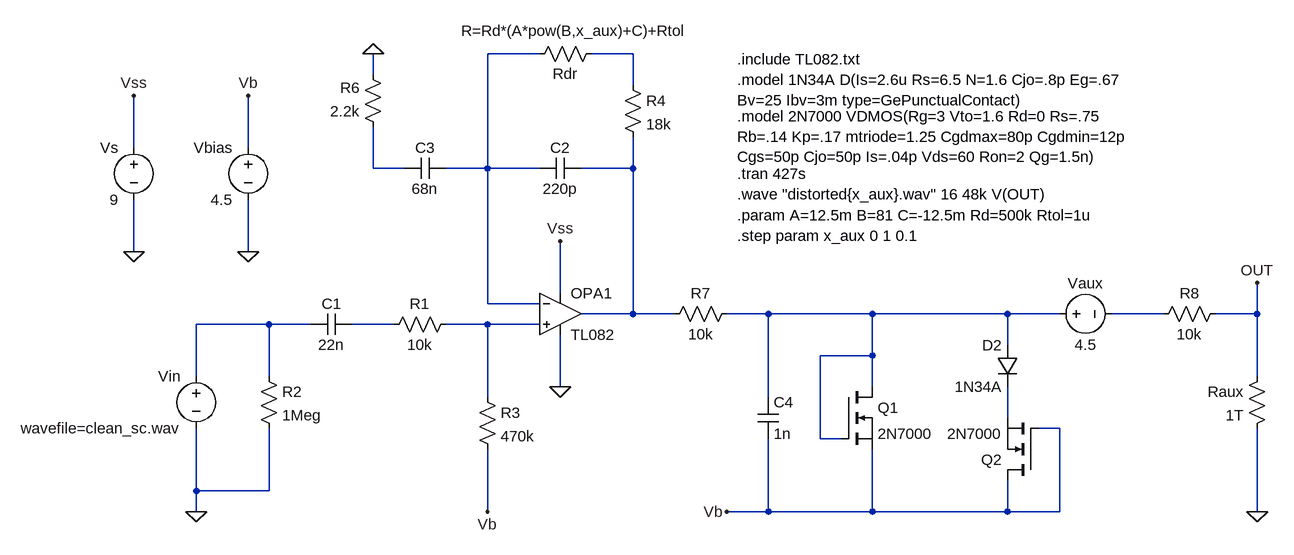
[diagram p0: schematic OCD_Distortion_Circuit.asc]
OCD_Distortion_Circuit.asc, the LTspice schematic file:
Version 4
SHEET 1 2244 884
WIRE -272 -96 -352 -96
WIRE -128 -96 -192 -96
WIRE -528 -64 -528 -96
WIRE -128 -48 -128 -96
WIRE -896 48 -896 -32
WIRE -720 48 -720 -32
WIRE -528 80 -528 16
WIRE -480 80 -528 80
WIRE -352 80 -352 -96
WIRE -352 80 -416 80
WIRE -272 80 -352 80
WIRE -128 80 -128 32
WIRE -128 80 -208 80
WIRE -896 208 -896 128
WIRE -720 208 -720 128
WIRE -240 272 -240 192
WIRE -352 288 -352 80
WIRE -272 288 -352 288
WIRE -128 304 -128 80
WIRE -128 304 -208 304
WIRE -64 304 -128 304
WIRE 80 304 16 304
WIRE 240 304 80 304
WIRE 448 304 240 304
WIRE 528 304 448 304
WIRE 688 304 608 304
WIRE 832 304 832 256
WIRE 832 304 768 304
WIRE -688 320 -800 320
WIRE -624 320 -688 320
WIRE -496 320 -560 320
WIRE -352 320 -416 320
WIRE -272 320 -352 320
WIRE 448 352 448 304
WIRE 240 368 240 304
WIRE 240 368 160 368
WIRE -800 400 -800 320
WIRE -688 400 -688 320
WIRE 832 400 832 304
WIRE -240 416 -240 336
WIRE 240 416 240 368
WIRE -352 432 -352 320
WIRE 80 432 80 304
WIRE 448 464 448 416
WIRE 528 480 496 480
WIRE 160 496 160 368
WIRE 192 496 160 496
WIRE -800 576 -800 480
WIRE -688 576 -688 480
WIRE -688 576 -800 576
WIRE -800 608 -800 576
WIRE -352 608 -352 512
WIRE 80 608 80 496
WIRE 80 608 16 608
WIRE 240 608 240 512
WIRE 240 608 80 608
WIRE 448 608 448 560
WIRE 448 608 240 608
WIRE 528 608 528 480
WIRE 528 608 448 608
WIRE 832 608 832 480
FLAG -352 608 Vb
FLAG -240 416 0
FLAG -800 608 0
FLAG -528 -96 0
FLAG 16 608 Vb
FLAG -240 192 Vss
FLAG 832 608 0
FLAG 832 256 OUT
FLAG -720 -32 Vb
FLAG -896 -32 Vss
FLAG -720 208 0
FLAG -896 208 0
SYMBOL voltage -800 384 M0
SYMATTR InstName Vin
SYMATTR Value wavefile=clean_sc.wav
SYMBOL res -400 304 R90
WINDOW 0 0 56 VBottom 2
WINDOW 3 32 56 VTop 2
SYMATTR InstName R1
SYMATTR Value 10k
SYMBOL cap -560 304 R90
WINDOW 0 0 32 VBottom 2
WINDOW 3 32 32 VTop 2
SYMATTR InstName C1
SYMATTR Value 22n
SYMBOL res -704 384 R0
SYMATTR InstName R2
SYMATTR Value 1Meg
SYMBOL res -368 416 R0
SYMATTR InstName R3
SYMATTR Value 470k
SYMBOL OpAmps\\opamp2 -240 240 R0
SYMATTR InstName OPA1
SYMATTR Value TL082
SYMBOL cap -208 64 R90
WINDOW 0 0 32 VBottom 2
WINDOW 3 32 32 VTop 2
SYMATTR InstName C2
SYMATTR Value 220p
SYMBOL res -144 -64 R0
SYMATTR InstName R4
SYMATTR Value 18k
SYMBOL cap -416 64 R90
WINDOW 0 0 32 VBottom 2
WINDOW 3 32 32 VTop 2
SYMATTR InstName C3
SYMATTR Value 68n
SYMBOL res -512 32 R180
WINDOW 0 36 76 Left 2
WINDOW 3 36 40 Left 2
SYMATTR InstName R6
SYMATTR Value 2.2k
SYMBOL res 32 288 R90
WINDOW 0 0 56 VBottom 2
WINDOW 3 32 56 VTop 2
SYMATTR InstName R7
SYMATTR Value 10k
SYMBOL cap 64 432 R0
SYMATTR InstName C4
SYMATTR Value 1n
SYMBOL diode 464 352 M0
SYMATTR InstName D2
SYMATTR Value 1N34A
SYMBOL nmos 192 416 R0
SYMATTR InstName Q1
SYMATTR Value 2N7000
SYMBOL nmos 496 560 R180
SYMATTR InstName Q2
SYMATTR Value 2N7000
SYMBOL res 784 288 R90
WINDOW 0 0 56 VBottom 2
WINDOW 3 32 56 VTop 2
SYMATTR InstName R8
SYMATTR Value 10k
SYMBOL res -288 -80 R270
WINDOW 0 -30 56 VTop 2
WINDOW 3 67 70 VBottom 2
SYMATTR InstName Rdr
SYMATTR Value R=Rd*(A*pow(B,x_aux)+C)+Rtol
SYMBOL voltage 512 304 R270
WINDOW 0 32 56 VTop 2
WINDOW 3 -32 56 VBottom 2
SYMATTR InstName Vaux
SYMATTR Value 4.5
SYMBOL res 848 384 M0
SYMATTR InstName Raux
SYMATTR Value 1T
SYMBOL voltage -720 32 M0
SYMATTR InstName Vbias
SYMATTR Value 4.5
SYMBOL voltage -896 32 M0
SYMATTR InstName Vs
SYMATTR Value 9
TEXT 32 -88 Left 2 !.include TL082.txt
TEXT 32 88 Left 2 !.tran 427s
TEXT 32 -56 Left 2 !.model 1N34A D(Is=2.6u Rs=6.5 N=1.6 Cjo=.8p Eg=.67 \nBv=25 Ibv=3m type=GePunctualContact)
TEXT 32 0 Left 2 !.model 2N7000 VDMOS(Rg=3 Vto=1.6 Rd=0 Rs=.75 \nRb=.14 Kp=.17 mtriode=1.25 Cgdmax=80p Cgdmin=12p \nCgs=50p Cjo=50p Is=.04p Vds=60 Ron=2 Qg=1.5n)
TEXT 32 120 Left 2 !.wave "distorted{x_aux}.wav" 16 48k V(OUT)
TEXT 32 184 Left 2 !.step param x_aux 0 1 0.1
TEXT 32 152 Left 2 !.param A=12.5m B=81 C=-12.5m Rd=500k Rtol=1u

The netlist it stands for:
* OCD_Distortion_Circuit.asc
Vin N007 0 wavefile=clean_sc.wav
R1 N009 N008 10k
C1 N008 N007 22n
R2 N007 0 1Meg
R3 N009 Vb 470k
XOPA1 N009 N001 Vss 0 N004 TL082  ; pins In+ In- V+ V- OUT
C2 N004 N001 220p
R4 N002 N004 18k
C3 N001 N003 68n
R6 N003 0 2.2k
R7 N005 N004 10k
C4 N005 Vb 1n
D2 N005 N010 1N34A
M§Q1 N005 N005 Vb Vb 2N7000
M§Q2 Vb Vb N010 N010 2N7000
R8 OUT N006 10k
Rdr N001 N002 R=Rd*(A*pow(B,x_aux)+C)+Rtol
Vaux N005 N006 4.5
Raux OUT 0 1T
Vbias Vb 0 4.5
Vs Vss 0 9
.model D D
.lib standard.dio
.model NMOS NMOS
.model PMOS PMOS
.lib standard.mos
.include TL082.txt
.tran 427s
.model 1N34A D(Is=2.6u Rs=6.5 N=1.6 Cjo=.8p Eg=.67
Bv=25 Ibv=3m type=GePunctualContact)
.model 2N7000 VDMOS(Rg=3 Vto=1.6 Rd=0 Rs=.75
Rb=.14 Kp=.17 mtriode=1.25 Cgdmax=80p Cgdmin=12p
Cgs=50p Cjo=50p Is=.04p Vds=60 Ron=2 Qg=1.5n)
.wave "distorted{x_aux}.wav" 16 48k V(OUT)
.step param x_aux 0 1 0.1
.param A=12.5m B=81 C=-12.5m Rd=500k Rtol=1u
.backanno
.end